# Altium schematic sheet fakel.SchDoc
size 420 x 297 mm; Address1: Address1; Address2: Address2; Address3: Address3; Address4: Address4; DocumentNumber: АБВГ.123456.001 Э3; SheetNumber: 1; Scale: 1:1; DocumentType: Схема электрическая принципиальная; FirstReferrence: АБВГ.123456.001
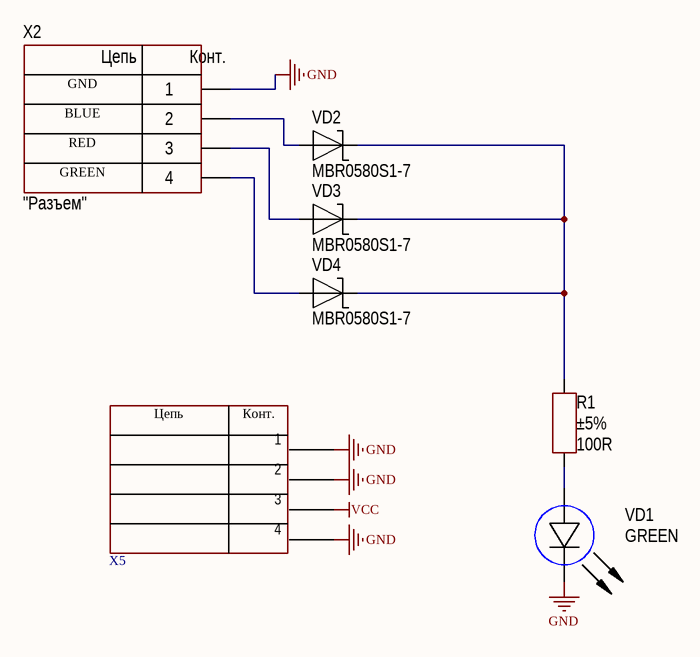
[diagram p0: fakel.SchDoc]

## Parts
R1  value 100R  Tolerance: ±5%  [RES: 0603]
VD1  Color: GREEN  [LED: 0805G]
VD2  PartNumber: MBR0580S1-7  [DIODE: SOD523]
VD3  PartNumber: MBR0580S1-7  [DIODE: SOD523]
VD4  PartNumber: MBR0580S1-7  [DIODE: SOD523]
X2  CommentText: "Разъем"  [CON: PBS-4 R]
X5  PBS-4 cut  [PBS-4 CUT]  (value not drawn)

## Nets
GND: VD1.2(C) X2.1 X5.1 X5.2 X5.4
VCC: X5.3
NetR1_1: R1.1 VD1.1(A)
NetR1_2: R1.2 VD2.2 VD3.2 VD4.2
NetVD2_1: VD2.1 X2.2
NetVD3_1: VD3.1 X2.3
NetVD4_1: VD4.1 X2.4

## Notes on the sheet
- (near X2) GND
- (near X2) RED
- (near X2) GREEN
- (near X2) BLUE
- Перв. примен.
- Справ. №
- Подп. и дата
- Инв. № дубл.
- Взам. инв. №
- Разраб.
- Изм.
- Лист
- № докум.
- Подп.
- Дата
- Лит.
- Масса
- Масштаб
- Пров.
- Т.контр.
- Листов
- Инв. № подл.
- Утв.
- Н.контр.
- 2.106-A3
- Копировал
- Формат А3
- (in symbol PBS-4) Цепь; Конт.
- (in symbol PBS-4 cut) Цепь; Конт.

## Library data of the parts
R1 = Resistor_0603: Manufacturer: Yageo; PartNumber: RC0603JR-07100RL; ValueManufacturerPartNumber: Resistor film, 100R, ±5%, 0603, 0.1W, -55...+125°C; TypeResistor: Resistor film; Power: 0.1W; Package: 0603; HelpURL: https://www.digikey.com/product-detail/en/yageo/RC0603JR-07100RL/311-100GRCT-ND/729644; Temperature: -55...+125°C
VD1 = LED_single: ValueManufacturerPartNumber: LED, *, *, *, -55...+150°C; TypeDiode: LED; Manufacturer: *; Package: *; HelpURL: *; Temperature: -55...+150°C; Current: *; VoltageDrop: *; PartNumber: *
VD2-VD4 = Schottky_single: Manufacturer: Diodes Incorporated; ValueManufacturerPartNumber: Schottky diode, 80V, 500mA, 1V, 15pF, SOD-123, -55...+150°C; TypeDiode: Schottky diode; Voltage: 80V; Current: 500mA; VoltageDrop: 1V; RecoveryTime: 15pF; Package: SOD-123; HelpURL: https://www.digikey.com/product-detail/en/diodes-incorporated/MBR0580S1-7/MBR0580S1-7DICT-ND/5080371; Temperature: -55...+150°C
X2 = PBS-4: Manufacturer: Connfly; ValueManufacturerPartNumber: Connector, 4pin, 2.54mm, 500VAC, 3A; TypeConnector: Connector; VoltageMax: 500VAC; Pitch: 2.54mm; CurrentMax: 3A; Multichannel: 4pin; HelpURL: https://www.chipdip.ru/product/pbs-4; PartNumber: PBS-4